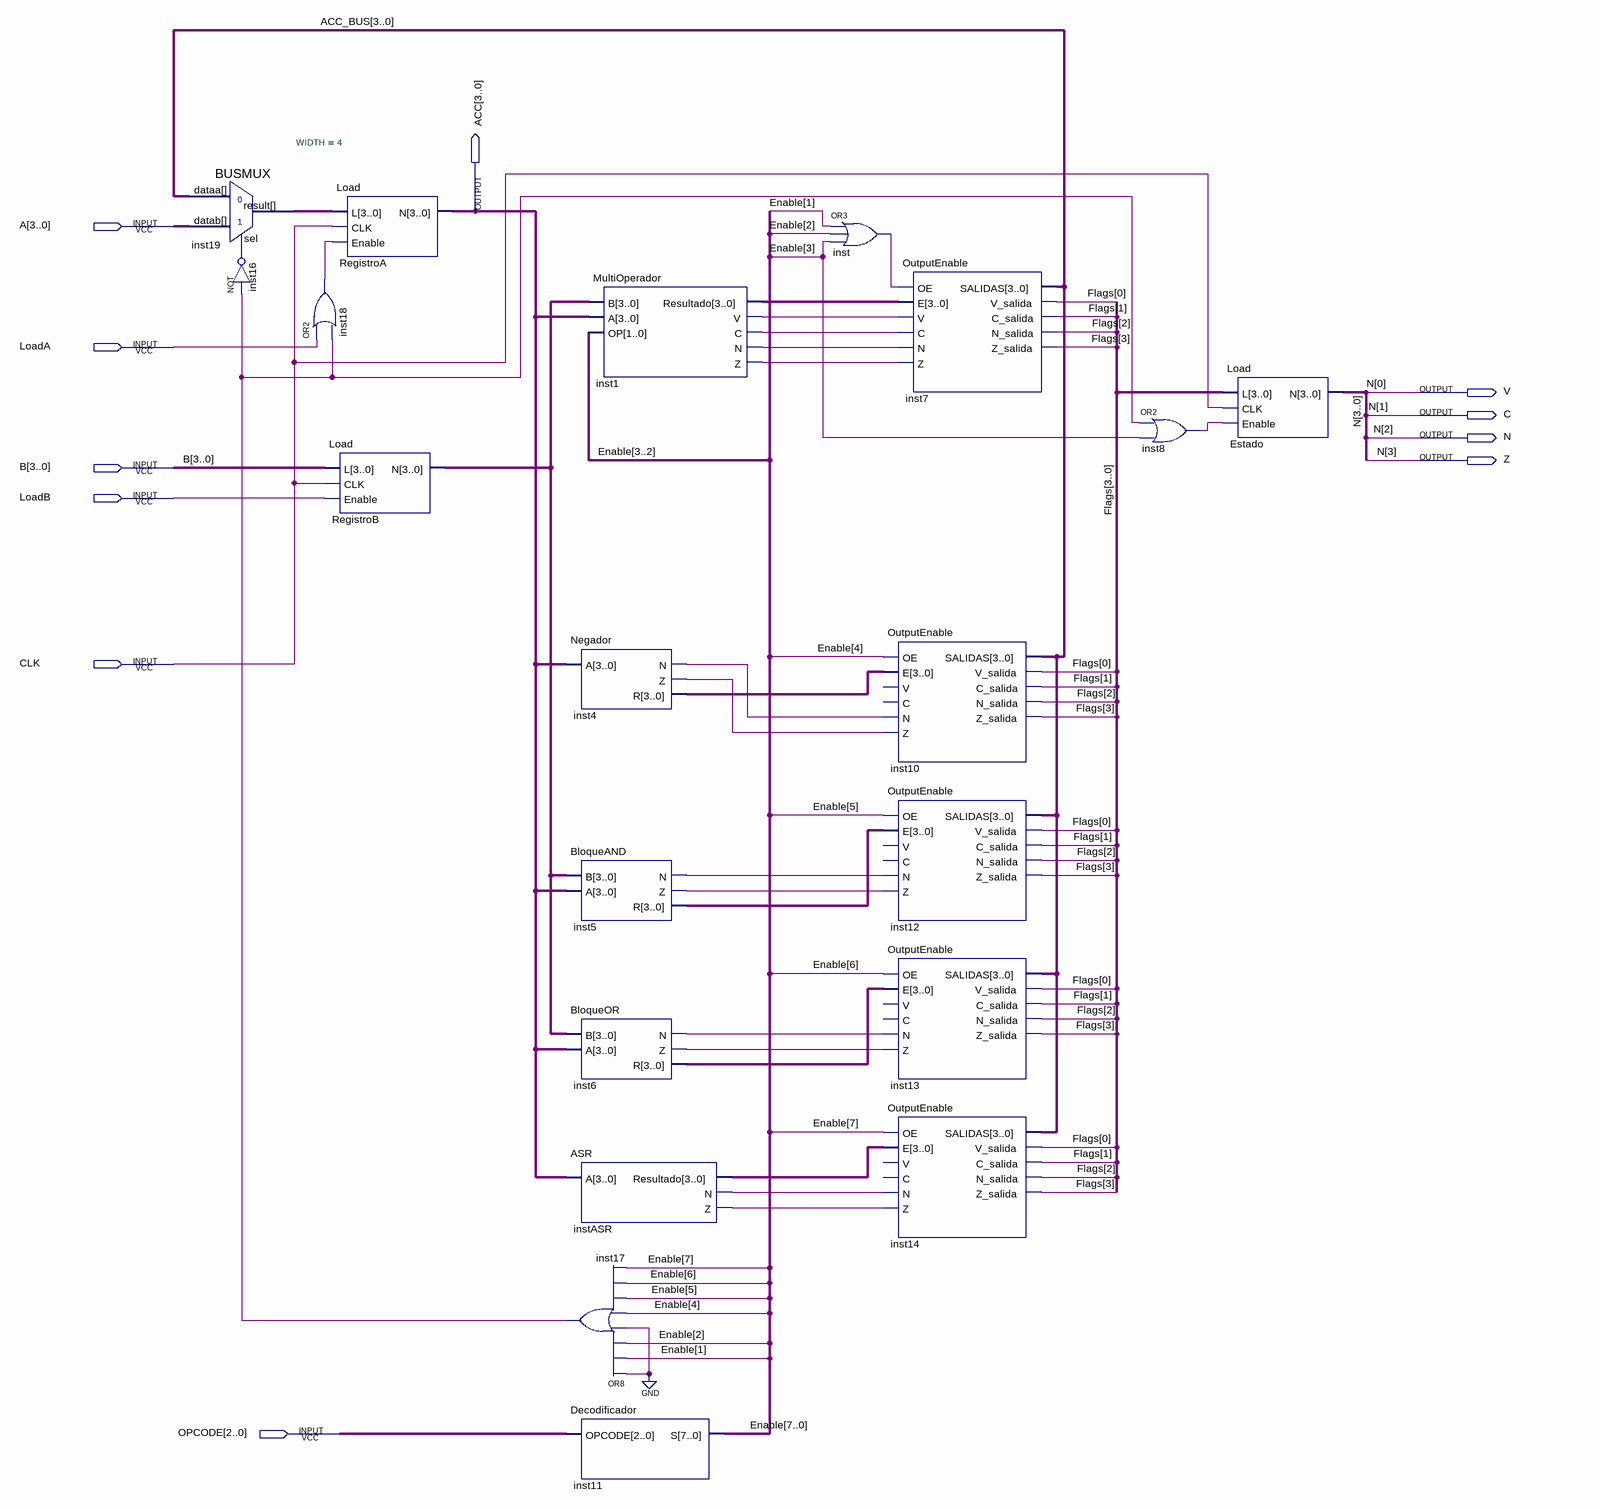
[diagram p0: schematic sheet]
// Quartus schematic TPIntegrador.bdf as structural Verilog: 20 symbols, 11 pins
module TPIntegrador (
  input  [3:0] A,
  input  LoadA,
  input  [3:0] B,
  input  LoadB,
  input  CLK,
  input  [2:0] OPCODE,
  output [3:0] ACC,
  output V,
  output C,
  output N,
  output Z
);

  wire inst1_c, inst1_n, inst1_v, inst1_z, inst4_n, inst4_z, inst5_n, inst5_z, inst6_n, inst6_z, inst8_out,
       inst16_out, inst17_out, inst18_out, inst_out, instASR_n, instASR_z;
  wire [3:0] ACC_BUS, Flags, inst1_resultado, inst4_r, inst5_r, inst6_r, inst19_result, instASR_resultado,
       RegistroB_n;
  wire [7:0] Enable;

  BUSMUX #(.WIDTH(4)) inst19 (.datab(A), .sel(inst16_out), .dataa(ACC_BUS), .result(inst19_result));
  not inst16 (inst16_out, inst17_out);
  or inst18 (inst18_out, LoadA, inst17_out);
  Load RegistroB (.L(B), .CLK(CLK), .Enable(LoadB), .N(RegistroB_n));
  Load RegistroA (.L(inst19_result), .CLK(CLK), .Enable(inst18_out), .N(ACC));
  Negador inst4 (.A(ACC), .N(inst4_n), .Z(inst4_z), .R(inst4_r));
  BloqueAND inst5 (.B(RegistroB_n), .A(ACC), .N(inst5_n), .Z(inst5_z), .R(inst5_r));
  BloqueOR inst6 (.B(RegistroB_n), .A(ACC), .N(inst6_n), .Z(inst6_z), .R(inst6_r));
  ASR instASR (.A(ACC), .Resultado(instASR_resultado), .N(instASR_n), .Z(instASR_z));
  or inst17 (inst17_out, 1'b0, Enable[1], Enable[2], 1'b0, Enable[4], Enable[5], Enable[6], Enable[7]);
  Decodificador inst11 (.OPCODE(OPCODE), .S(Enable));
  MultiOperador inst1 (
    .B(RegistroB_n), .A(ACC), .OP(Enable[3:2]), .Resultado(inst1_resultado), .V(inst1_v), .C(inst1_c),
    .N(inst1_n), .Z(inst1_z));
  or inst (inst_out, Enable[1], Enable[2], Enable[3]);
  OutputEnable inst7 (
    .OE(inst_out), .E(inst1_resultado), .V(inst1_v), .C(inst1_c), .N(inst1_n), .Z(inst1_z),
    .SALIDAS(ACC_BUS), .V_salida(Flags[0]), .C_salida(Flags[1]), .N_salida(Flags[2]), .Z_salida(Flags[3]));
  OutputEnable inst10 (
    .OE(Enable[4]), .E(inst4_r), .N(inst4_n), .Z(inst4_z), .SALIDAS(ACC_BUS), .V_salida(Flags[0]),
    .C_salida(Flags[1]), .N_salida(Flags[2]), .Z_salida(Flags[3]));  // open: V, C
  OutputEnable inst12 (
    .OE(Enable[5]), .E(inst5_r), .N(inst5_n), .Z(inst5_z), .SALIDAS(ACC_BUS), .V_salida(Flags[0]),
    .C_salida(Flags[1]), .N_salida(Flags[2]), .Z_salida(Flags[3]));  // open: V, C
  OutputEnable inst13 (
    .OE(Enable[6]), .E(inst6_r), .N(inst6_n), .Z(inst6_z), .SALIDAS(ACC_BUS), .V_salida(Flags[0]),
    .C_salida(Flags[1]), .N_salida(Flags[2]), .Z_salida(Flags[3]));  // open: V, C
  OutputEnable inst14 (
    .OE(Enable[7]), .E(instASR_resultado), .N(instASR_n), .Z(instASR_z), .SALIDAS(ACC_BUS),
    .V_salida(Flags[0]), .C_salida(Flags[1]), .N_salida(Flags[2]), .Z_salida(Flags[3]));  // open: V, C
  or inst8 (inst8_out, inst17_out, Enable[3]);
  Load Estado (.L(Flags), .CLK(CLK), .Enable(inst8_out), .N({Z, N, C, V}));

  // Other names for the same wires on the sheet: N[3:0] = {Z, N, C, V}
endmodule
